# Altium project CNC Controller.PrjPCB
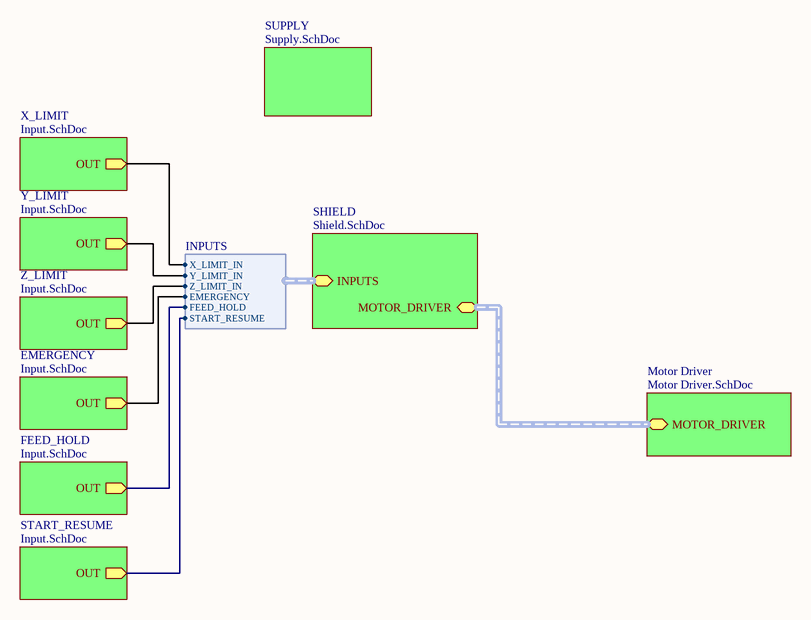
[diagram p0: Index.SchDoc]
5 sheets, 90 parts. Net scope: hierarchical (ports join the sheet entries above them; power ports are global).
Board file: CNC Controller.PcbDoc
Sheets:
  Index.SchDoc
    X_LIMIT = Input.SchDoc
    Motor Driver = Motor Driver.SchDoc
    SHIELD = Shield.SchDoc
    Z_LIMIT = Input.SchDoc
    EMERGENCY = Input.SchDoc
    SUPPLY = Supply.SchDoc
    Y_LIMIT = Input.SchDoc
    FEED_HOLD = Input.SchDoc
    START_RESUME = Input.SchDoc

## Sheet Index.SchDoc
size A4

### Sub-sheets
EMERGENCY = Input.SchDoc: OUT (out)
FEED_HOLD = Input.SchDoc: OUT (out)
Motor Driver = Motor Driver.SchDoc: MOTOR_DRIVER (harness MOTOR_DRIVER)
SHIELD = Shield.SchDoc: MOTOR_DRIVER (harness MOTOR_DRIVER), INPUTS (harness INPUTS)
START_RESUME = Input.SchDoc: OUT (out)
SUPPLY = Supply.SchDoc: no entries
X_LIMIT = Input.SchDoc: OUT (out)
Y_LIMIT = Input.SchDoc: OUT (out)
Z_LIMIT = Input.SchDoc: OUT (out)

### Harnesses
INPUTS: X_LIMIT_IN, Y_LIMIT_IN, Z_LIMIT_IN, EMERGENCY, FEED_HOLD, START_RESUME

### Nets
EMERGENCY: sheet EMERGENCY/OUT, sheet SHIELD/INPUTS.EMERGENCY
FEED_HOLD: sheet FEED_HOLD/OUT, sheet SHIELD/INPUTS.FEED_HOLD
LIMIT_X: sheet X_LIMIT/OUT, sheet SHIELD/INPUTS.X_LIMIT_IN
LIMIT_Y: sheet Y_LIMIT/OUT, sheet SHIELD/INPUTS.Y_LIMIT_IN
LIMIT_Z: sheet Z_LIMIT/OUT, sheet SHIELD/INPUTS.Z_LIMIT_IN
START_RESUME: sheet START_RESUME/OUT, sheet SHIELD/INPUTS.START_RESUME

### Buses and harness runs
harness sheet Motor Driver/MOTOR_DRIVER = sheet SHIELD/MOTOR_DRIVER

## Sheet Input.SchDoc
size A4
Used 6 times, as channels X_LIMIT, Z_LIMIT, EMERGENCY, Y_LIMIT, FEED_HOLD, START_RESUME. Parts and nets are listed once, with the designators drawn on the sheet.
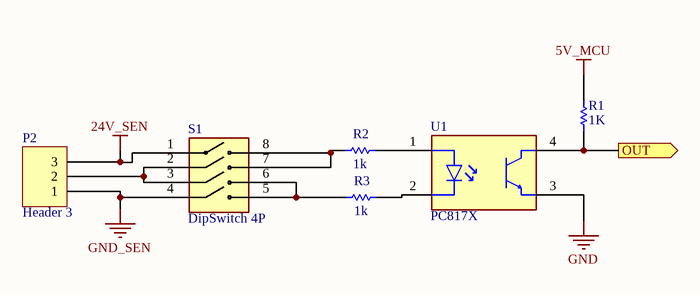
[diagram p1: Input.SchDoc]

### Parts
P2  Header 3  [HDR1X3]
R1  value 1K  [SMT0805_M]  (hidden comment: 0805/.125W/5Q)
R2  value 1k  [SMT0805_M]  (hidden comment: 0805/.125W/5Q)
R3  value 1k  [SMT0805_M]  (hidden comment: 0805/.125W/5Q)
S1  DipSwitch 4P  [DS-04]
U1  PC817X  [DIP-4]

### Ports
OUT (out)

### Nets
5V_MCU: R1.2
24V_SEN: P2.3 S1.1
GND: U1.3(E)
GND_SEN: P2.1 S1.4
OUT: R1.1 U1.4(C) ; port OUT
NetP2_2: P2.2 S1.2 S1.3
NetR2_1: R2.1 S1.7 S1.8
NetR2_2: R2.2 U1.1(A)
NetR3_1: R3.1 S1.5 S1.6
NetR3_2: R3.2 U1.2(K)

### Channels
X_LIMIT: designators end in _X; ports OUT=LIMIT_X
Z_LIMIT: designators end in _Z; ports OUT=LIMIT_Z
EMERGENCY: designators end in _EMG; ports OUT=EMERGENCY
Y_LIMIT: designators end in _Y; ports OUT=LIMIT_Y
FEED_HOLD: designators end in _FEED; ports OUT=FEED_HOLD
START_RESUME: designators end in _STRT; ports OUT=START_RESUME

### Library data of the parts
P2 = Header 3: Header, 3-Pin; LatestRevisionDate: 17-Jul-2002; LatestRevisionNote: Re-released for DXP Platform.; Publisher: Altium Limited
R1-R3 = Res1: Resistor; Published: 8-Jun-2000; LatestRevisionDate: 17-Jul-2002; LatestRevisionNote: Re-released for DXP Platform.; PackageReference: AXIAL-0.3; Publisher: Altium Limited; PackageDescription: Axial Device, Thru-Hole; 2 Leads; 0.3 in Pin Spacing
S1 = DS-04

## Sheet Motor Driver.SchDoc
size A4; PageSetup: Record=PageOptions|CenterHorizontal=True|CenterVertical=True|PrintScale=0.98|XCorrection=1.00|YCorrection=1.00|PrintKind=2|BorderSize=5000000|LeftOffset=0|BottomOffset=0|Orientation=2|PaperLength=1000|PaperWidth=1000|Scale=100|PaperSource=7|PrintQuality=-4|MediaType=1|DitherType=10|PaperKind=A4|PrintScaleMode=1; DrawnBy: HENRIQUE THIESEN; Organization: Altium Limited; Address1: L3, 12a Rodborough Rd; Address2: Frenchs Forest; Address3: NSW; Address4: Australia 2086; DocumentNumber: 3; SheetNumber: 3; SheetTotal: 9; Project: WEG AirCon DAQ Adapter
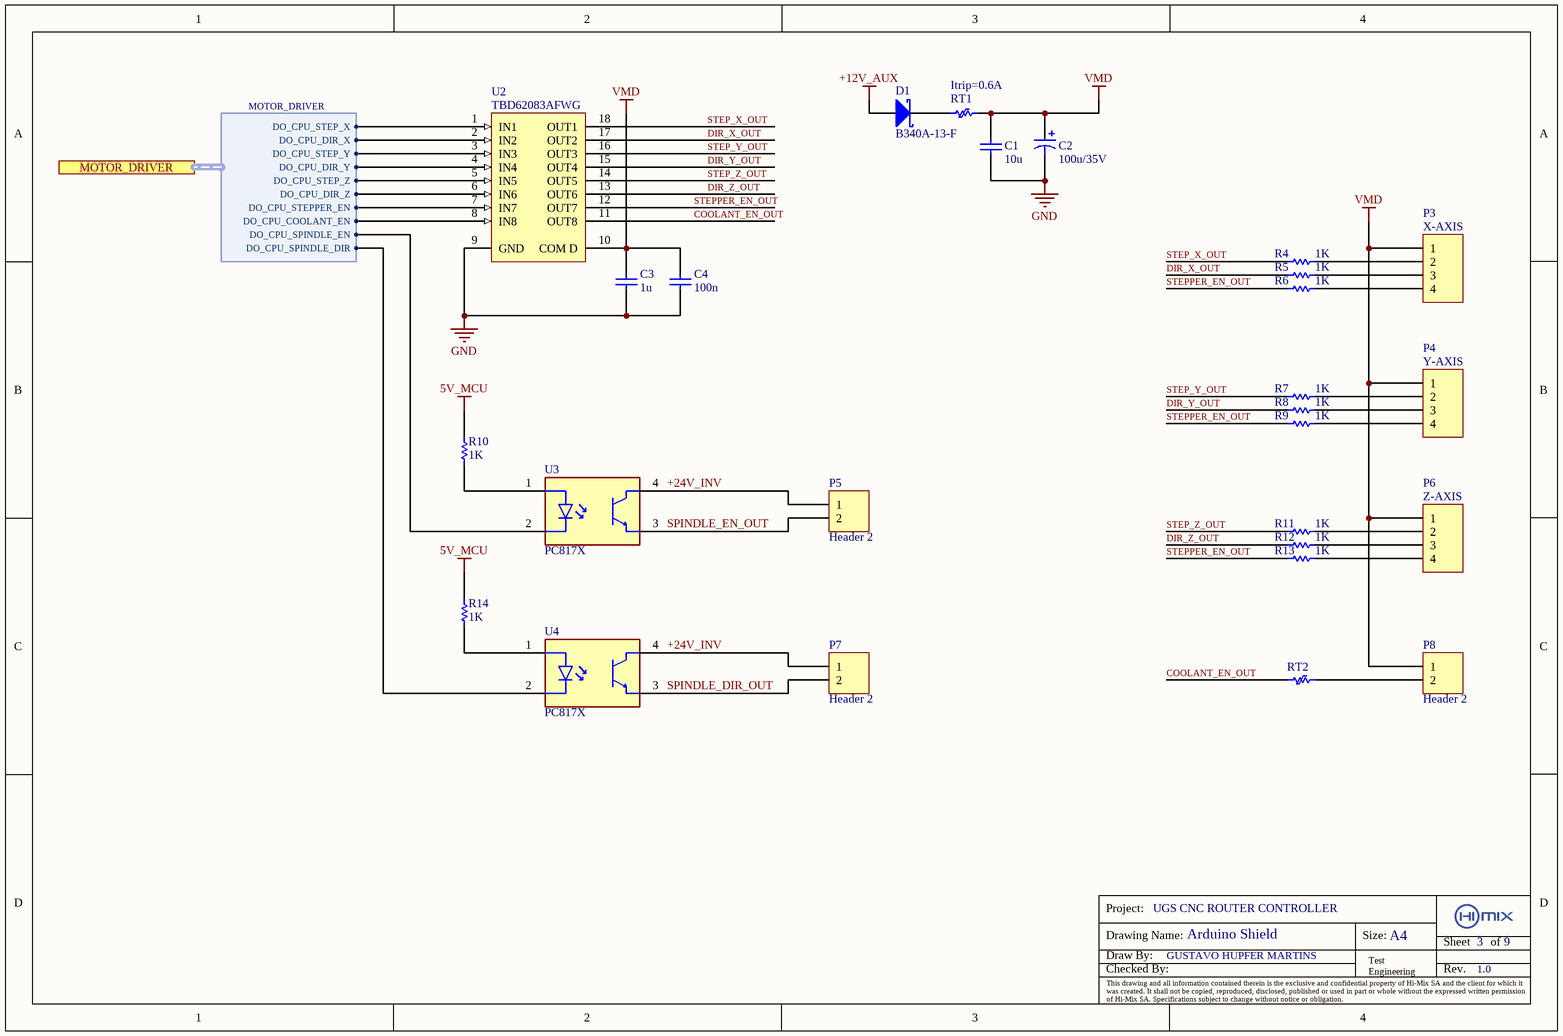
[diagram p2: Motor Driver.SchDoc]

### Parts
C1  value 10u  [SMT1210_M]  (hidden comment: X7R/1210/50V)
C2  value 100u/35V  [FKV Panasonic 8x10.2L (F)]  (hidden comment: 8x10.2)
C3  value 1u  [SMT0805_N]  (hidden comment: X7R/0805/50V)
C4  value 100n  [SMT0603_N]  (hidden comment: X7R/0603/50V)
D1  B340A-13-F  [SMB]
P3  Desc.: X-AXIS  [HDR1X4]
P4  Desc.: Y-AXIS  [HDR1X4]
P5  Header 2  [HDR1X2]
P6  Desc.: Z-AXIS  [HDR1X4]
P7  Header 2  [HDR1X2]
P8  Header 2  [HDR1X2]
R4  value 1K  [SMT1210_M]  (hidden comment: 1210/.5W/1Q)
R5  value 1K  [SMT1210_M]  (hidden comment: 1210/.5W/1Q)
R6  value 1K  [SMT1210_M]  (hidden comment: 1210/.5W/1Q)
R7  value 1K  [SMT1210_M]  (hidden comment: 1210/.5W/1Q)
R8  value 1K  [SMT1210_M]  (hidden comment: 1210/.5W/1Q)
R9  value 1K  [SMT1210_M]  (hidden comment: 1210/.5W/1Q)
R10  value 1K  [SMT1210_M]  (hidden comment: 1210/.5W/1Q)
R11  value 1K  [SMT1210_M]  (hidden comment: 1210/.5W/1Q)
R12  value 1K  [SMT1210_M]  (hidden comment: 1210/.5W/1Q)
R13  value 1K  [SMT1210_M]  (hidden comment: 1210/.5W/1Q)
R14  value 1K  [SMT1210_M]  (hidden comment: 1210/.5W/1Q)
RT1  Itrip=0.6A  [AXIAL-0.2]
RT2  Poly Switch  [AXIAL-0.2]  (value not drawn)
U2  TBD62083AFWG  [SOIC18]
U3  PC817X  [DIP-4]
U4  PC817X  [DIP-4]

### Ports
MOTOR_DRIVER (harness MOTOR_DRIVER)

### Harnesses
MOTOR_DRIVER: DO_CPU_STEP_X, DO_CPU_STEP_Y, DO_CPU_STEP_Z, DO_CPU_DIR_X, DO_CPU_DIR_Y, DO_CPU_DIR_Z, DO_CPU_STEPPER_EN, DO_CPU_COOLANT_EN, DO_CPU_SPINDLE_EN, DO_CPU_SPINDLE_DIR

### Nets
5V_MCU: R10.1 R14.1
+12V_AUX: D1.1(A)
GND: C1.1 C2.2 C3.1 C4.1 U2.9(GND)
VMD: C1.2 C2.1 C3.2 C4.2 P3.1 P4.1 P6.1 P8.1 RT1.1 U2.10(COM_D)
+24V_INV: P5.1 P7.1 U3.4(C) U4.4(C)
COOLANT_EN_OUT: RT2.1 U2.11(OUT8)
DIR_X_OUT: R5.1 U2.17(OUT2)
DIR_Y_OUT: R8.1 U2.15(OUT4)
DIR_Z_OUT: R12.1 U2.13(OUT6)
DO_CPU_COOLANT_EN: U2.8(IN8) ; port MOTOR_DRIVER.DO_CPU_COOLANT_EN
DO_CPU_DIR_X: U2.2(IN2) ; port MOTOR_DRIVER.DO_CPU_DIR_X
DO_CPU_DIR_Y: U2.4(IN4) ; port MOTOR_DRIVER.DO_CPU_DIR_Y
DO_CPU_DIR_Z: U2.6(IN6) ; port MOTOR_DRIVER.DO_CPU_DIR_Z
DO_CPU_SPINDLE_DIR: U4.2(K) ; port MOTOR_DRIVER.DO_CPU_SPINDLE_DIR
DO_CPU_SPINDLE_EN: U3.2(K) ; port MOTOR_DRIVER.DO_CPU_SPINDLE_EN
DO_CPU_STEP_X: U2.1(IN1) ; port MOTOR_DRIVER.DO_CPU_STEP_X
DO_CPU_STEP_Y: U2.3(IN3) ; port MOTOR_DRIVER.DO_CPU_STEP_Y
DO_CPU_STEP_Z: U2.5(IN5) ; port MOTOR_DRIVER.DO_CPU_STEP_Z
DO_CPU_STEPPER_EN: U2.7(IN7) ; port MOTOR_DRIVER.DO_CPU_STEPPER_EN
SPINDLE_DIR_OUT: P7.2 U4.3(E)
SPINDLE_EN_OUT: P5.2 U3.3(E)
STEP_X_OUT: R4.1 U2.18(OUT1)
STEP_Y_OUT: R7.1 U2.16(OUT3)
STEP_Z_OUT: R11.1 U2.14(OUT5)
STEPPER_EN_OUT: R6.1 R9.1 R13.1 U2.12(OUT7)
NetD1_2: D1.2(K) RT1.2
NetP3_2: P3.2 R4.2
NetP3_3: P3.3 R5.2
NetP3_4: P3.4 R6.2
NetP4_2: P4.2 R7.2
NetP4_3: P4.3 R8.2
NetP4_4: P4.4 R9.2
NetP6_2: P6.2 R11.2
NetP6_3: P6.3 R12.2
NetP6_4: P6.4 R13.2
NetP8_2: P8.2 RT2.2
NetR10_2: R10.2 U3.1(A)
NetR14_2: R14.2 U4.1(A)

### Notes on the sheet
- UGS CNC ROUTER CONTROLLER
- GUSTAVO HUPFER MARTINS
- Arduino Shield
- 1.0
- Project:
- Drawing Name:
- Checked By:
- Draw By:
- Size:
- Test
  Engineering
- A4
- Sheet
- Rev.
- of
- This drawing and all information contained therein is the exclusive and confidential property of Hi-Mix SA and the client for which it was created. It shall not be copied, reproduced, disclosed, published or used in part or whole without the expressed written permission of Hi-Mix SA. Specifications subject to change without notice or obligation.

### Library data of the parts
C1 = Cap: Capacitor; PN: C3225X7S1H106K; MFT: TDK; Published: 8-Jun-2000; LatestRevisionDate: 17-Jul-2002; LatestRevisionNote: Re-released for DXP Platform.; PackageReference: RAD-0.3; Publisher: Altium Limited; PackageDescription: Radial Cap, Thru-Hole; 2 Leads; 0.3 in Pin Spacing
C2 = Cap Pol1: Polarized Capacitor (Radial); PN: EEEFP1V221AP; MFT: PANASONIC
C3 C4 = Cap: Capacitor; Published: 8-Jun-2000; LatestRevisionDate: 17-Jul-2002; LatestRevisionNote: Re-released for DXP Platform.; PackageReference: RAD-0.3; Publisher: Altium Limited; PackageDescription: Radial Cap, Thru-Hole; 2 Leads; 0.3 in Pin Spacing
D1 = D Schottky: Schottky Diode; MFT: DIODES; PN1: MBRA340T3G; MFT1: ON; PN: B340A-13-F
P3 P4 P6 = Header 4: Header, 4-Pin; LatestRevisionDate: 17-Jul-2002; LatestRevisionNote: Re-released for DXP Platform.; Publisher: Altium Limited
P5 P7 P8 = Header 2: Header, 2-Pin; LatestRevisionDate: 17-Jul-2002; LatestRevisionNote: Re-released for DXP Platform.; Publisher: Altium Limited
R4-R14 = Res1: Resistor; Published: 8-Jun-2000; LatestRevisionDate: 17-Jul-2002; LatestRevisionNote: Re-released for DXP Platform.; PackageReference: AXIAL-0.3; Publisher: Altium Limited; PackageDescription: Axial Device, Thru-Hole; 2 Leads; 0.3 in Pin Spacing
RT1 = Poly Switch: Thermistor; PN: RXEF030; MFT: BOURNS; Published: 24-Mar-1999; LatestRevisionDate: 29-May-2009; LatestRevisionNote: IPC-7351 Footprint Added.; PackageVersion: Mar-2003; PackageReference: 6-0805; Publisher: Altium Limited; PackageDescription: Chip Resistor 0805 Case Size; Code_IPC: RESC2012
RT2 = Poly Switch: Thermistor; Published: 24-Mar-1999; LatestRevisionDate: 29-May-2009; LatestRevisionNote: IPC-7351 Footprint Added.; PackageVersion: Mar-2003; PackageReference: 6-0805; Publisher: Altium Limited; PackageDescription: Chip Resistor 0805 Case Size; Code_IPC: RESC2012
U2 = ULN2803LW: High-Voltage, High-Current Darlington Array; MFT: TOSHIBA; PN: TBD62083AFWG; REF: https://br.mouser.com/ProductDetail/Toshiba/TBD62083AFWGEL?qs=fSnNYG2PaKJPpDBB6xK1QA%3D%3D

## Sheet Shield.SchDoc
size A4; PageSetup: Record=PageOptions|CenterHorizontal=True|CenterVertical=True|PrintScale=0.98|XCorrection=1.00|YCorrection=1.00|PrintKind=2|BorderSize=5000000|LeftOffset=0|BottomOffset=0|Orientation=2|PaperLength=1000|PaperWidth=1000|Scale=100|PaperSource=7|PrintQuality=-4|MediaType=1|DitherType=10|PaperKind=A4|PrintScaleMode=1; DrawnBy: HENRIQUE THIESEN; Organization: Altium Limited; Address1: L3, 12a Rodborough Rd; Address2: Frenchs Forest; Address3: NSW; Address4: Australia 2086; DocumentNumber: 3; SheetNumber: 3; SheetTotal: 9; Project: WEG AirCon DAQ Adapter
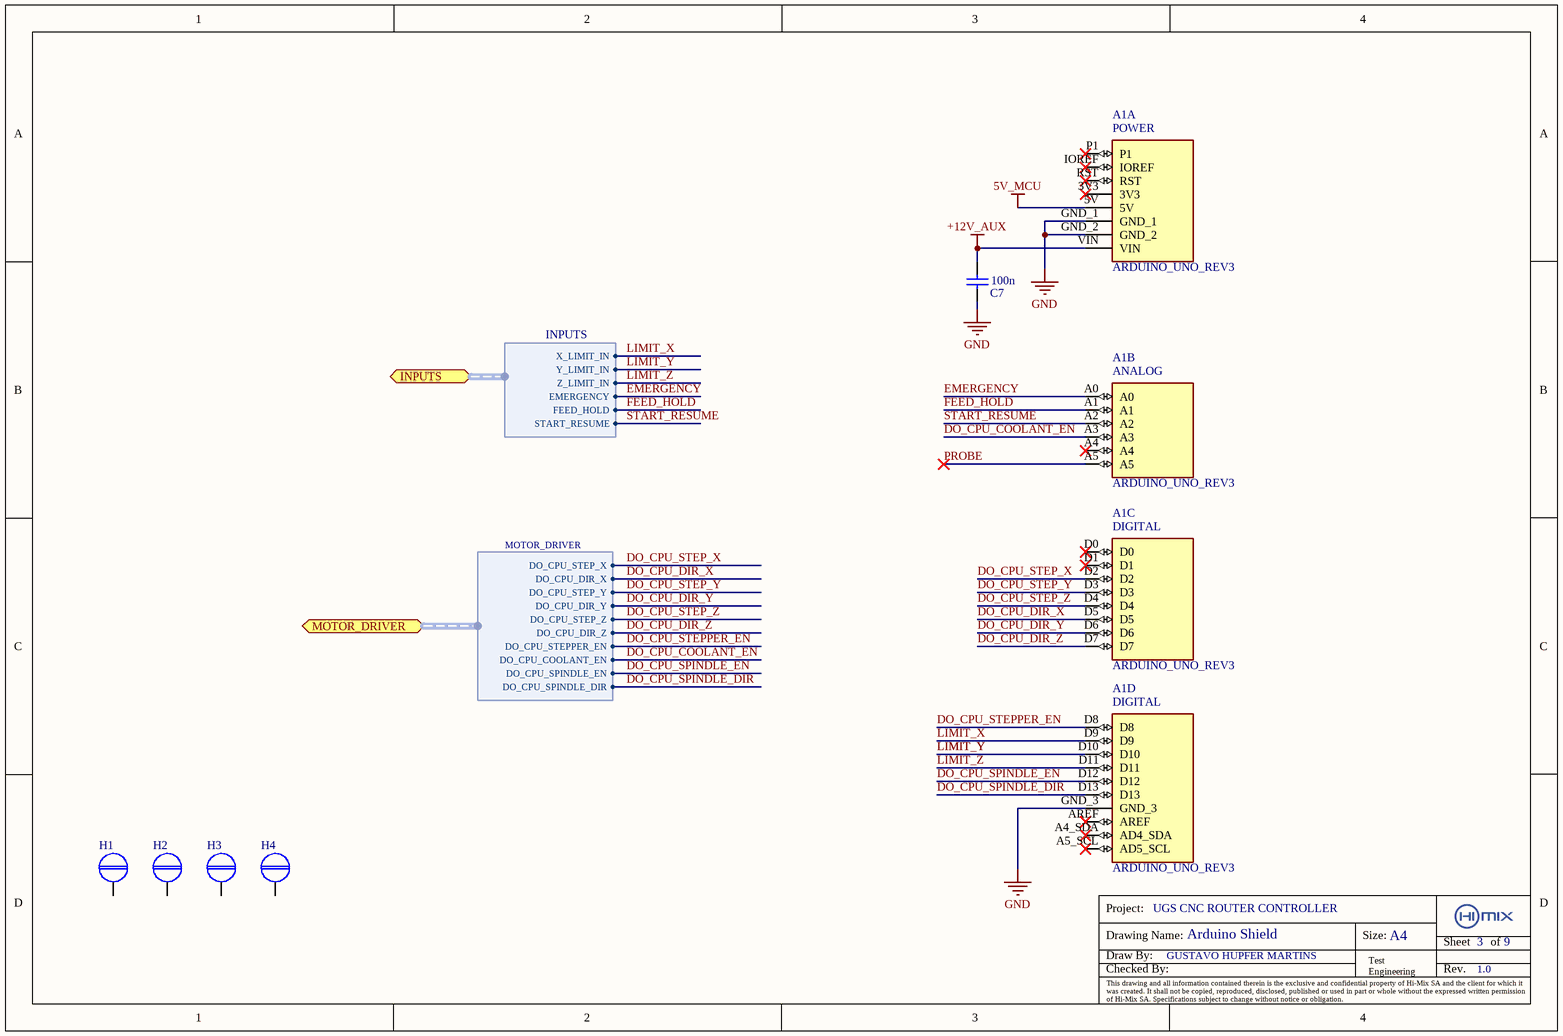
[diagram p3: Shield.SchDoc]

### Parts
A1  ARDUINO_UNO_REV3  [ARDUINO_ARDUINO_UNO_REV3]  (parts A,B,C,D of 4)
C7  value 100n  [SMT0805_M]  (hidden comment: Capacitor)
H1  Hole  [Hole 3.2mm x 6.5mm]  (value not drawn)  (no BOM)
H2  Hole  [Hole 3.2mm x 6.5mm]  (value not drawn)  (no BOM)
H3  Hole  [Hole 3.2mm x 6.5mm]  (value not drawn)  (no BOM)
H4  Hole  [Hole 3.2mm x 6.5mm]  (value not drawn)  (no BOM)

### Ports
INPUTS (harness INPUTS), MOTOR_DRIVER (harness MOTOR_DRIVER)

### Harnesses
MOTOR_DRIVER: DO_CPU_STEP_X, DO_CPU_STEP_Y, DO_CPU_STEP_Z, DO_CPU_DIR_X, DO_CPU_DIR_Y, DO_CPU_DIR_Z, DO_CPU_STEPPER_EN, DO_CPU_COOLANT_EN, DO_CPU_SPINDLE_EN, DO_CPU_SPINDLE_DIR
INPUTS: X_LIMIT_IN, Y_LIMIT_IN, Z_LIMIT_IN, EMERGENCY, FEED_HOLD, START_RESUME

### Nets
5V_MCU: A1.5V
+12V_AUX: A1.VIN C7.2
GND: A1.GND_1 A1.GND_2 A1.GND_3 C7.1
DO_CPU_COOLANT_EN: A1.A3 ; port MOTOR_DRIVER.DO_CPU_COOLANT_EN
DO_CPU_DIR_X: A1.D5 ; port MOTOR_DRIVER.DO_CPU_DIR_X
DO_CPU_DIR_Y: A1.D6 ; port MOTOR_DRIVER.DO_CPU_DIR_Y
DO_CPU_DIR_Z: A1.D7 ; port MOTOR_DRIVER.DO_CPU_DIR_Z
DO_CPU_SPINDLE_DIR: A1.D13 ; port MOTOR_DRIVER.DO_CPU_SPINDLE_DIR
DO_CPU_SPINDLE_EN: A1.D12 ; port MOTOR_DRIVER.DO_CPU_SPINDLE_EN
DO_CPU_STEP_X: A1.D2 ; port MOTOR_DRIVER.DO_CPU_STEP_X
DO_CPU_STEP_Y: A1.D3 ; port MOTOR_DRIVER.DO_CPU_STEP_Y
DO_CPU_STEP_Z: A1.D4 ; port MOTOR_DRIVER.DO_CPU_STEP_Z
DO_CPU_STEPPER_EN: A1.D8 ; port MOTOR_DRIVER.DO_CPU_STEPPER_EN
EMERGENCY: A1.A0 ; port INPUTS.EMERGENCY
FEED_HOLD: A1.A1 ; port INPUTS.FEED_HOLD
LIMIT_X: A1.D9 ; port INPUTS.X_LIMIT_IN
LIMIT_Y: A1.D10 ; port INPUTS.Y_LIMIT_IN
LIMIT_Z: A1.D11 ; port INPUTS.Z_LIMIT_IN
PROBE: A1.A5
START_RESUME: A1.A2 ; port INPUTS.START_RESUME

Not connected (* = marked no-connect by the designer): A1 3V3* A4* A4_SDA(AD4_SDA)* A5_SCL(AD5_SCL)* AREF* D0* D1* IOREF* P1* RST*; H1 1; H2 1; H3 1; H4 1

### Notes on the sheet
- UGS CNC ROUTER CONTROLLER
- GUSTAVO HUPFER MARTINS
- Arduino Shield
- 1.0
- Project:
- Drawing Name:
- Checked By:
- Draw By:
- Size:
- Test
  Engineering
- A4
- Sheet
- Rev.
- of
- This drawing and all information contained therein is the exclusive and confidential property of Hi-Mix SA and the client for which it was created. It shall not be copied, reproduced, disclosed, published or used in part or whole without the expressed written permission of Hi-Mix SA. Specifications subject to change without notice or obligation.
- (in symbol ARDUINO_UNO_REV3, part A) POWER
- (in symbol ARDUINO_UNO_REV3, part B) ANALOG
- (in symbol ARDUINO_UNO_REV3, part C) DIGITAL
- (in symbol ARDUINO_UNO_REV3, part D) DIGITAL

### Library data of the parts
A1 = ARDUINO_UNO_REV3: Microcontroller board based on the ATmega328P.; MP: ARDUINO UNO REV3; SnapEDA_Link: https://www.snapeda.com/parts/ARDUINO%20UNO%20REV3/Arduino/view-part/?ref=snap; Package: Non-Standard Arduino; Value: *; MF: Arduino; Check_prices: https://www.snapeda.com/parts/ARDUINO%20UNO%20REV3/Arduino/view-part/?ref=eda
C7 = Capacitor: Published: 8-Jun-2000; LatestRevisionDate: 17-Jul-2002; LatestRevisionNote: Re-released for DXP Platform.; PackageReference: RAD-0.3; Publisher: Altium Limited; PackageDescription: Radial Cap, Thru-Hole; 2 Leads; 0.3 in Pin Spacing

## Sheet Supply.SchDoc
size A4
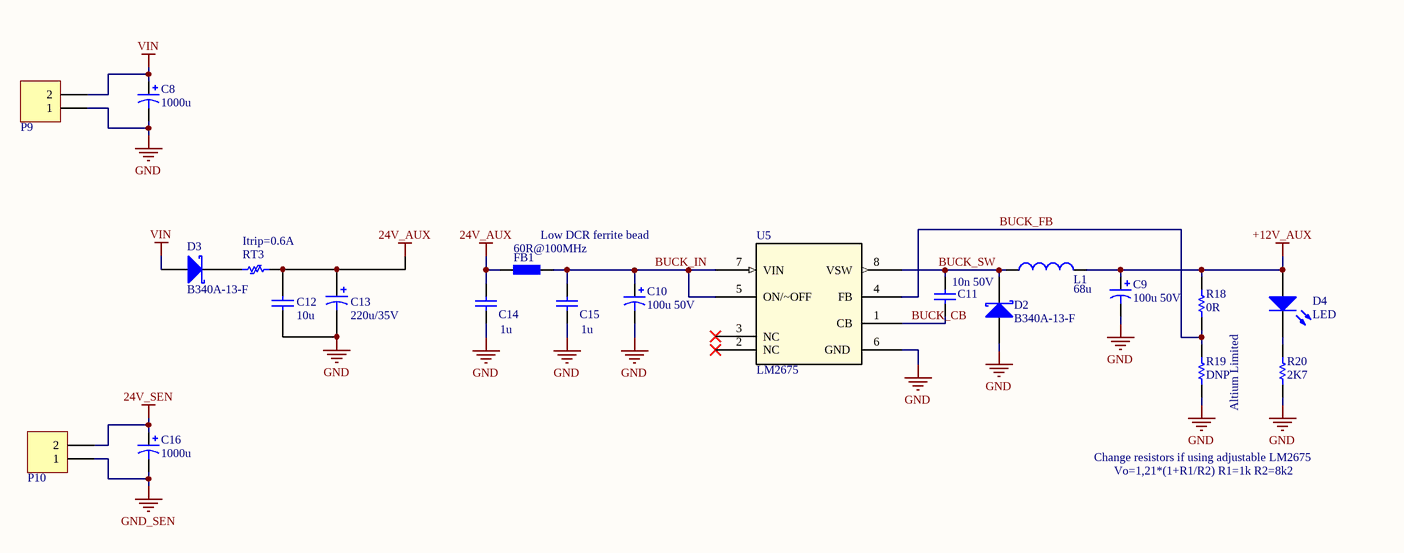
[diagram p4: Supply.SchDoc]

### Parts
C8  value 1000u  [CAP_P10MM-D22MM]  (hidden comment: Cap Pol2)
C9  value 100u 50V  [FKV Panasonic 6.3x7.7L (D8)]  (hidden comment: Cap Pol2)
C10  value 100u 50V  [FKV Panasonic 6.3x7.7L (D8)]  (hidden comment: Cap Pol2)
C11  value 10n 50V  [SMD_CAP_0805]  (hidden comment: Capacitor)
C12  value 10u  [SMT1210_M]  (hidden comment: X7R/1210/50V)
C13  value 220u/35V  [FKV Panasonic 8x10.2L (F)]  (hidden comment: 8x10.2)
C14  value 1u  [SMT0805_M]  (hidden comment: Capacitor)
C15  value 1u  [SMT0805_M]  (hidden comment: Capacitor)
C16  value 1000u  [CAP_P10MM-D22MM]  (hidden comment: Cap Pol2)
D2  B340A-13-F  [SMB]
D3  B340A-13-F  [SMB]
D4  LED  [LED-3mm]
FB1  60R@100MHz  [SMT0805_M]
L1  value 68u  [IND MSS1278 COILCRAFT]  (hidden comment: Inductor)
P9  ECH350V-02P  [ECH350V-02P]  (value not drawn)
P10  ECH350V-02P  [ECH350V-02P]  (value not drawn)
R18  value 0R  [SMD_RES_0805]  (hidden comment: Res)
R19  value DNP  Publisher: Altium Limited  [SMD_RES_0805]  (hidden comment: Res)  (no BOM)
R20  value 2K7  [SMT0805_M]  (hidden comment: Res)
RT3  Itrip=0.6A  [AXIAL-0.2]
U5  LM2675  [SOIC-8-M]

### Nets
24V_AUX: C12.2 C13.1 C14.2 FB1.1 RT3.1
24V_SEN: C16.1 P10.2
+12V_AUX: C9.1 D4.1(A) L1.2 R18.1
GND: C8.2 C9.2 C10.2 C12.1 C13.2 C14.1 C15.1 D2.1(A) P9.1 R19.2 R20.1 U5.6(GND)
GND_SEN: C16.2 P10.1
VIN: C8.1 D3.1(A) P9.2
BUCK_CB: C11.1 U5.1(CB)
BUCK_FB: R18.2 R19.1 U5.4(FB)
BUCK_IN: C10.1 C15.2 FB1.2 U5.5(ON/~OFF) U5.7(VIN)
BUCK_SW: C11.2 D2.2(K) L1.1 U5.8(VSW)
NetD3_2: D3.2(K) RT3.2
NetD4_2: D4.2(K) R20.2

Not connected (* = marked no-connect by the designer): U5 2(NC)* 3(NC)*

### Notes on the sheet
- (near FB1) Low DCR ferrite bead
- Change resistors if using adjustable LM2675
- Vo=1,21*(1+R1/R2) R1=1k R2=8k2

### Library data of the parts
C8-C10 C16 = Cap Pol2: Polarized Capacitor (Axial); Published: 8-Jun-2000; LatestRevisionDate: 17-Jul-2002; LatestRevisionNote: Re-released for DXP Platform.; PackageReference: POLAR0.8; Publisher: Altium Limited; PackageDescription: Polarized Capacitor; 2 Leads
C12 = Cap: Capacitor; PN: C3225X7S1H106K; MFT: TDK; Published: 8-Jun-2000; LatestRevisionDate: 17-Jul-2002; LatestRevisionNote: Re-released for DXP Platform.; PackageReference: RAD-0.3; Publisher: Altium Limited; PackageDescription: Radial Cap, Thru-Hole; 2 Leads; 0.3 in Pin Spacing
C13 = Cap Pol1: Polarized Capacitor (Radial); PN: EEEFP1V221AP; MFT: PANASONIC; PN1: EEE-FK1V221P; MFT1: PANASONIC
D2 D3 = D Schottky: as D1 on sheet Motor Driver; PN: B340A-13-F
D4 = LED: Typical INFRARED GaAs LED; Published: 8-Jun-2000; LatestRevisionDate: 08-Jul-2005; LatestRevisionNote: Mech Layer 1 removed.; PackageReference: LED-0; Publisher: Altium Limited; PackageDescription: LED; 2 Leads
FB1 = Ferrite Bead
R18-R20 = Res: Resistor; Published: 8-Jun-2000; LatestRevisionDate: 17-Jul-2002; LatestRevisionNote: Re-released for DXP Platform.; PackageReference: AXIAL-0.3; PackageDescription: Axial Device, Thru-Hole; 2 Leads; 0.3 in Pin Spacing
  R18 R20: Publisher: Altium Limited
RT3 = Poly Switch: Thermistor; PN: RXEF030; MFT: BOURNS; Published: 24-Mar-1999; LatestRevisionDate: 29-May-2009; LatestRevisionNote: IPC-7351 Footprint Added.; PackageVersion: Mar-2003; PackageReference: 6-0805; Publisher: Altium Limited; PackageDescription: Chip Resistor 0805 Case Size; Code_IPC: RESC2012
U5 = LM2675: SIMPLE SWITCHER&reg; 6.5V to 40V, 1A Low Component Count Step-Down Regulator 8-SOIC -40 to 125; Manufacturer_Name: Texas Instruments; Manufacturer_Part_Number: LM2675M-12; Type: LM2675M-12; Copyright: Copyright (C) 2025 Ultra Librarian. All rights reserved.; Datasheet: https://www.ti.com/lit/gpn/lm2675; RefDes: RefDes
C11 C14 C15 = Capacitor: Published: 8-Jun-2000; LatestRevisionDate: 17-Jul-2002; LatestRevisionNote: Re-released for DXP Platform.; PackageReference: RAD-0.3; Publisher: Altium Limited; PackageDescription: Radial Cap, Thru-Hole; 2 Leads; 0.3 in Pin Spacing

## Nets that join several sheets
5V_MCU: X_LIMIT (R1_X.2), Motor Driver (R10.1 R14.1), Shield (A1.5V), Z_LIMIT (R1_Z.2), EMERGENCY (R1_EMG.2), Y_LIMIT (R1_Y.2), FEED_HOLD (R1_FEED.2), START_RESUME (R1_STRT.2)
24V_SEN: X_LIMIT (P2_X.3 S1_X.1), Z_LIMIT (P2_Z.3 S1_Z.1), EMERGENCY (P2_EMG.3 S1_EMG.1), Supply (C16.1 P10.2), Y_LIMIT (P2_Y.3 S1_Y.1), FEED_HOLD (P2_FEED.3 S1_FEED.1), START_RESUME (P2_STRT.3 S1_STRT.1)
+12V_AUX: Motor Driver (D1.1), Shield (A1.VIN C7.2), Supply (C9.1 D4.1 L1.2 R18.1)
GND: X_LIMIT (U1_X.3), Motor Driver (5 pins), Shield (A1.GND_1 A1.GND_2 A1.GND_3 C7.1), Z_LIMIT (U1_Z.3), EMERGENCY (U1_EMG.3), Supply (12 pins), Y_LIMIT (U1_Y.3), FEED_HOLD (U1_FEED.3), START_RESUME (U1_STRT.3)
GND_SEN: X_LIMIT (P2_X.1 S1_X.4), Z_LIMIT (P2_Z.1 S1_Z.4), EMERGENCY (P2_EMG.1 S1_EMG.4), Supply (C16.2 P10.1), Y_LIMIT (P2_Y.1 S1_Y.4), FEED_HOLD (P2_FEED.1 S1_FEED.4), START_RESUME (P2_STRT.1 S1_STRT.4)
DO_CPU_COOLANT_EN: Motor Driver (U2.8), Shield (A1.A3)
DO_CPU_DIR_X: Motor Driver (U2.2), Shield (A1.D5)
DO_CPU_DIR_Y: Motor Driver (U2.4), Shield (A1.D6)
DO_CPU_DIR_Z: Motor Driver (U2.6), Shield (A1.D7)
DO_CPU_SPINDLE_DIR: Motor Driver (U4.2), Shield (A1.D13)
DO_CPU_SPINDLE_EN: Motor Driver (U3.2), Shield (A1.D12)
DO_CPU_STEP_X: Motor Driver (U2.1), Shield (A1.D2)
DO_CPU_STEP_Y: Motor Driver (U2.3), Shield (A1.D3)
DO_CPU_STEP_Z: Motor Driver (U2.5), Shield (A1.D4)
DO_CPU_STEPPER_EN: Motor Driver (U2.7), Shield (A1.D8)
EMERGENCY: Shield (A1.A0), EMERGENCY (R1_EMG.1 U1_EMG.4)
FEED_HOLD: Shield (A1.A1), FEED_HOLD (R1_FEED.1 U1_FEED.4)
LIMIT_X: X_LIMIT (R1_X.1 U1_X.4), Shield (A1.D9)
LIMIT_Y: Shield (A1.D10), Y_LIMIT (R1_Y.1 U1_Y.4)
LIMIT_Z: Shield (A1.D11), Z_LIMIT (R1_Z.1 U1_Z.4)
START_RESUME: Shield (A1.A2), START_RESUME (R1_STRT.1 U1_STRT.4)